# EAGLE design PWM-Shield-v12 (EAGLE 5.06)
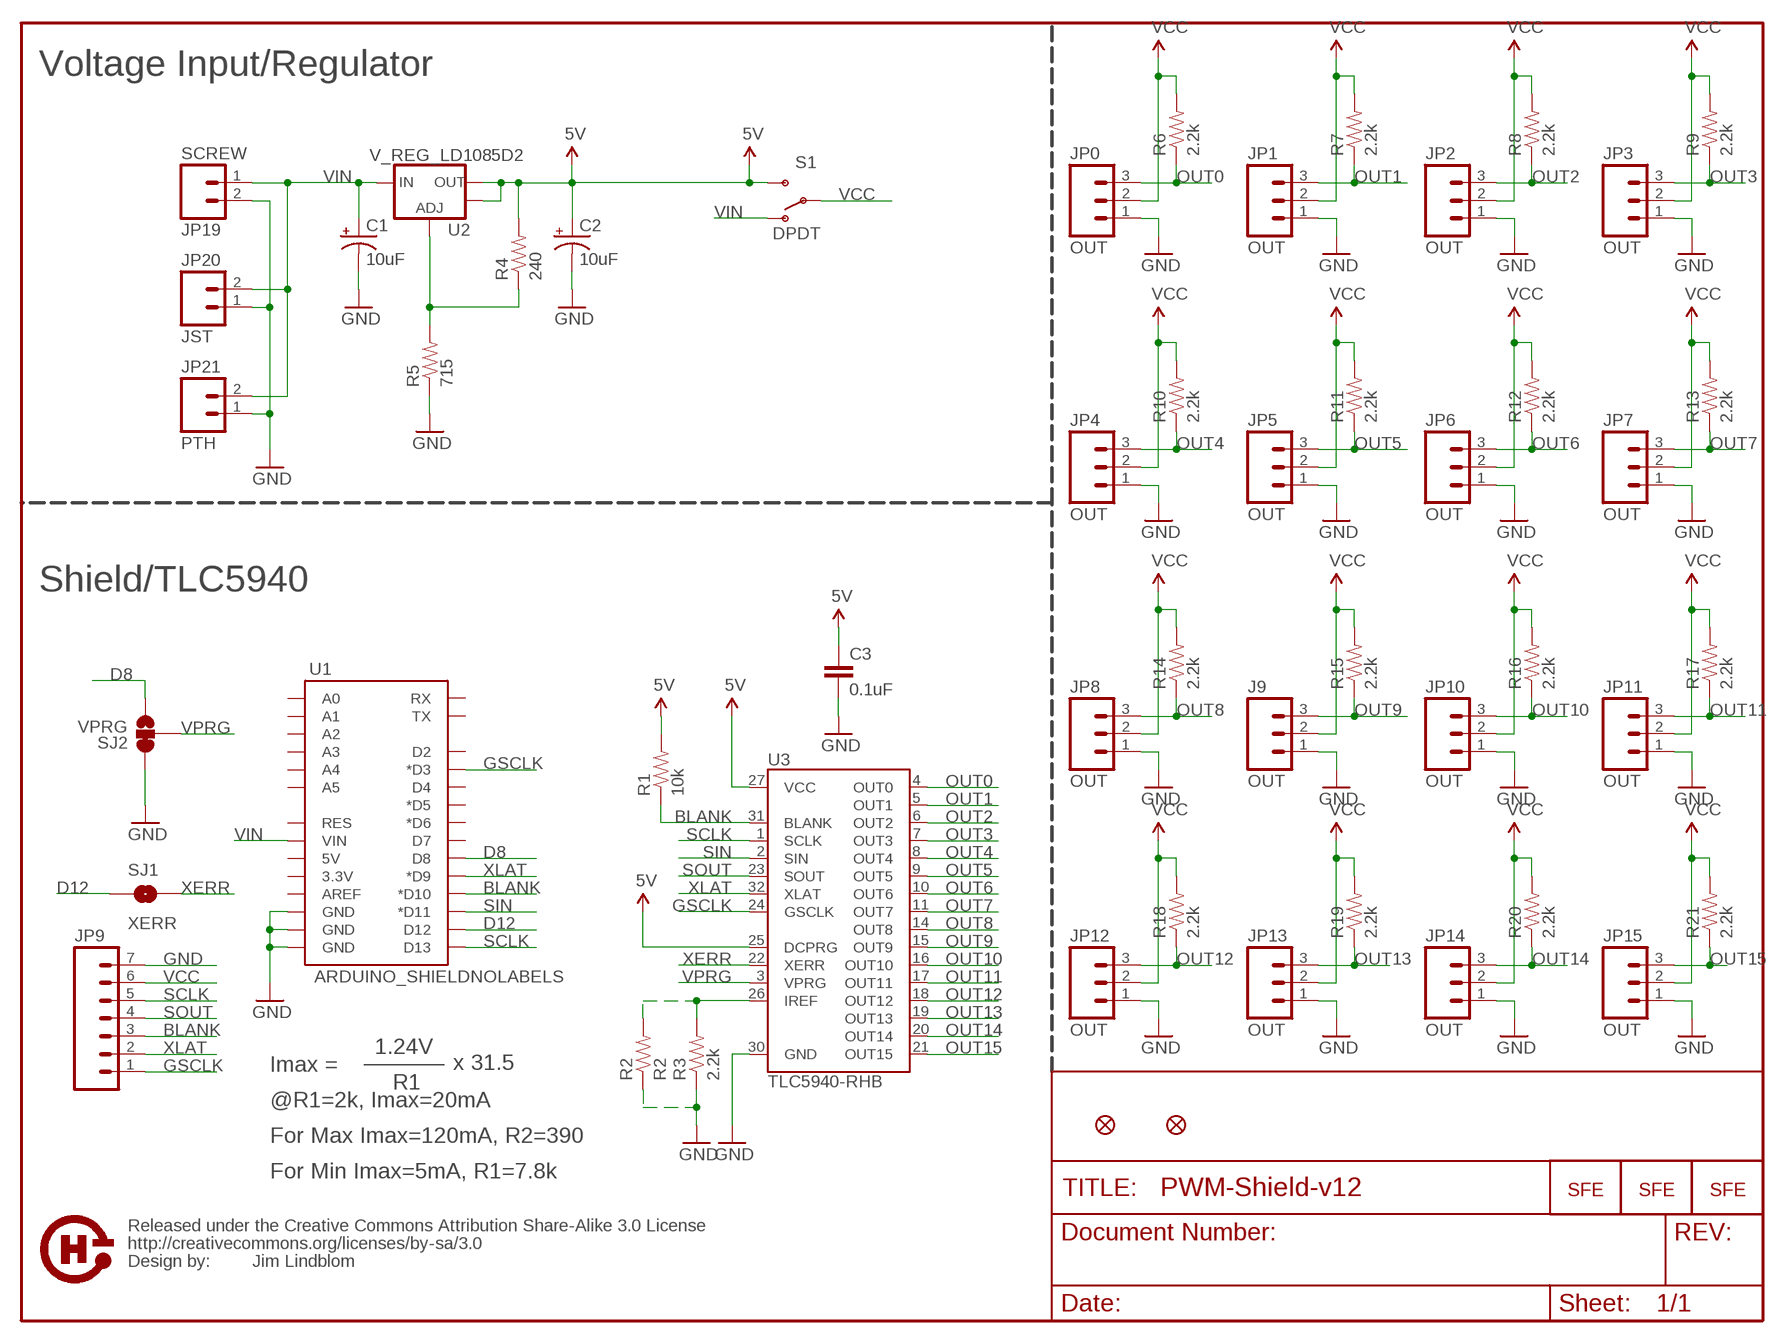
[diagram p0: schematic, sheet 1]

## Parts
C1  10uF  CAP_POL3528  [EIA3528]
C2  10uF  CAP_POL1206  [EIA3216]
C3  0.1uF  CAP0402-CAP  [0402-CAP]
J9  OUT  M03PTH  [1X03]
JP0  OUT  M03PTH  [1X03]
JP1  OUT  M03PTH  [1X03]
JP2  OUT  M03PTH  [1X03]
JP3  OUT  M03PTH  [1X03]
JP4  OUT  M03PTH  [1X03]
JP5  OUT  M03PTH  [1X03]
JP6  OUT  M03PTH  [1X03]
JP7  OUT  M03PTH  [1X03]
JP8  OUT  M03PTH  [1X03]
JP9  M07  [1X07]
JP10  OUT  M03PTH  [1X03]
JP11  OUT  M03PTH  [1X03]
JP12  OUT  M03PTH  [1X03]
JP13  OUT  M03PTH  [1X03]
JP14  OUT  M03PTH  [1X03]
JP15  OUT  M03PTH  [1X03]
JP16  LOGO-SFENEW  [SFE-NEW-WEBLOGO]
JP17  LOGO-SFESK  [SFE-LOGO-FLAME]
JP18  LOGO-SFENW2  [SFE-NEW-WEB]
JP19  SCREW  M023.5MM-NO_SILK  [SCREWTERMINAL-3.5MM-2-NS]
JP20  JST  M02JST-PTH-2  [JST-2-PTH]
JP21  PTH  M02PTH  [1X02]
JP22  FIDUCIAL1X2  [FIDUCIAL-1X2]
JP23  FIDUCIAL1X2  [FIDUCIAL-1X2]
R1  10k  RESISTOR0402-RES  [0402-RES]
R2  R2  RESISTORAXIAL-0.3  [AXIAL-0.3]
R3  2.2k  RESISTOR0402-RES  [0402-RES]
R4  240  RESISTOR0402-RES  [0402-RES]
R5  715  RESISTOR0402-RES  [0402-RES]
R6  2.2k  RESISTOR0402-RES  [0402-RES]
R7  2.2k  RESISTOR0402-RES  [0402-RES]
R8  2.2k  RESISTOR0402-RES  [0402-RES]
R9  2.2k  RESISTOR0402-RES  [0402-RES]
R10  2.2k  RESISTOR0402-RES  [0402-RES]
R11  2.2k  RESISTOR0402-RES  [0402-RES]
R12  2.2k  RESISTOR0402-RES  [0402-RES]
R13  2.2k  RESISTOR0402-RES  [0402-RES]
R14  2.2k  RESISTOR0402-RES  [0402-RES]
R15  2.2k  RESISTOR0402-RES  [0402-RES]
R16  2.2k  RESISTOR0402-RES  [0402-RES]
R17  2.2k  RESISTOR0402-RES  [0402-RES]
R18  2.2k  RESISTOR0402-RES  [0402-RES]
R19  2.2k  RESISTOR0402-RES  [0402-RES]
R20  2.2k  RESISTOR0402-RES  [0402-RES]
R21  2.2k  RESISTOR0402-RES  [0402-RES]
S1  DPDT  SWITCH-SPSTSMD  [AYZ0202]
SJ1  XERR  SOLDERJUMPERNO  [SJ_2S-NO]
SJ2  VPRG  SOLDERJUMPER_2WAYS  [SJ_3]
U1  ARDUINO_SHIELDNOLABELS  [DUEMILANOVE_SHIELD_NOLABELS]
U2  V_REG_LD1085D2  [D2PACK/A]
U3  TLC5940-RHB  [QFN-32]
U$1  OSHW-LOGOORB  [OSHW-LOGO-GO]
U$2  CREATIVE_COMMONS  [CREATIVE_COMMONS]

## Nets
5V: C2.A(+) C3.1 R1.2 R4.2 S1.3(S) U2.2(OUT) U2.TAB(OUT) U3.25(DCPRG) U3.27(VCC)
BLANK: JP9.3 R1.1 U1.D10(*D10) U3.31(BLANK)
D8: SJ2.3 U1.D8
D12: SJ1.1 U1.D12
GND: C1.C(-) C2.C(-) C3.2 J9.1 JP0.1 JP1.1 JP2.1 JP3.1 JP4.1 JP5.1 JP6.1 JP7.1 JP8.1 JP9.7 JP10.1 JP11.1 JP12.1 JP13.1 JP14.1 JP15.1 JP19.2 JP20.1 JP21.1 R2.P$1 R3.1 R5.1 SJ2.1 U1.GND@0(GND) U1.GND@1(GND) U1.GND@2(GND) U3.30(GND)
GSCLK: JP9.1 U1.D3(*D3) U3.24(GSCLK)
N$2: R4.1 R5.2 U2.1(ADJ)
N$8: R2.P$2 R3.2 U3.26(IREF)
OUT0: JP0.3 R6.1 U3.4(OUT0)
OUT1: JP1.3 R7.1 U3.5(OUT1)
OUT2: JP2.3 R8.1 U3.6(OUT2)
OUT3: JP3.3 R9.1 U3.7(OUT3)
OUT4: JP4.3 R10.1 U3.8(OUT4)
OUT5: JP5.3 R11.1 U3.9(OUT5)
OUT6: JP6.3 R12.1 U3.10(OUT6)
OUT7: JP7.3 R13.1 U3.11(OUT7)
OUT8: JP8.3 R14.1 U3.14(OUT8)
OUT9: J9.3 R15.1 U3.15(OUT9)
OUT10: JP10.3 R16.1 U3.16(OUT10)
OUT11: JP11.3 R17.1 U3.17(OUT11)
OUT12: JP12.3 R18.1 U3.18(OUT12)
OUT13: JP13.3 R19.1 U3.19(OUT13)
OUT14: JP14.3 R20.1 U3.20(OUT14)
OUT15: JP15.3 R21.1 U3.21(OUT15)
SCLK: JP9.5 U1.D13 U3.1(SCLK)
SIN: U1.D11(*D11) U3.2(SIN)
SOUT: JP9.4 U3.23(SOUT)
VCC: J9.2 JP0.2 JP1.2 JP2.2 JP3.2 JP4.2 JP5.2 JP6.2 JP7.2 JP8.2 JP9.6 JP10.2 JP11.2 JP12.2 JP13.2 JP14.2 JP15.2 R6.2 R7.2 R8.2 R9.2 R10.2 R11.2 R12.2 R13.2 R14.2 R15.2 R16.2 R17.2 R18.2 R19.2 R20.2 R21.2 S1.2(P)
VIN: C1.A(+) JP19.1 JP20.2 JP21.2 S1.1(O) U1.VIN U2.3(IN)
VPRG: SJ2.2 U3.3(VPRG)
XERR: SJ1.2 U3.22(XERR)
XLAT: JP9.2 U1.D9(*D9) U3.32(XLAT)
Unconnected: U1.3.3V U1.5V U1.A0 U1.A1 U1.A2 U1.A3 U1.A4 U1.A5 U1.AREF U1.D2 U1.D4 U1.D5(*D5) U1.D6(*D6) U1.D7 U1.RES U1.RX U1.TX

## Notes on the sheet
- Voltage Input/Regulator
- Shield/TLC5940
- 1.24V
- Imax = | x 31.5
- R1
- @R1=2k, Imax=20mA
- For Max Imax=120mA, R2=390
- For Min Imax=5mA, R1=7.8k
- Jim Lindblom

## Library data of the parts
C1 C2 = SparkFun:CAP_POL: Capacitor Polarized These are standard SMD and PTH capacitors. Normally 10uF, 47uF, and 100uF in electrolytic and tantalum varieties. Always verify the external diameter of the through hole cap, it varies with capacity, voltage, and manufacturer. The EIA devices should be standard.
C3 = SparkFun:CAP: Capacitor Standard 0603 ceramic capacitor, and 0.1" leaded capacitor.
J9 JP0 JP1-JP8 JP10-JP15 = SparkFun:M03: Header 3 Standard 3-pin 0.1" header. Use with straight break away headers (SKU : PRT-00116), right angle break away headers (PRT-00553), swiss pins (PRT-00743), machine pins (PRT-00117), and female headers (PRT-00115). Molex polarized connector foot print use with SKU : PRT-08232 with associated crimp pins and housings.
JP9 = SparkFun:M07: Header 7 Standard 7-pin 0.1" header. Use with straight break away headers (SKU : PRT-00116), right angle break away headers (PRT-00553), swiss pins (PRT-00743), machine pins (PRT-00117), and female headers (PRT-00115). NOTES ON THE VARIANTS LOCK and LOCK_LONGPADS... This footprint was designed to help hold the alignment of a through-hole component (i.e. 7-pin header) while soldering it into place. You may notice that each hole has been shifted either up or down by 0.005 of an inch from it's more standard position (which is usually a perfectly straight line). This slight alteration caused the pins (the squares in the middle) to touch the edges of the holes. Because they are alternating, it causes a "brace" to hold the header in place. 0.005 has proven to be the perfect amount of "off-center" position when using our standard breakaway headers. Although looks a little odd when you look at the bare footprint, once you have a header in there, the alteration is very hard to notice. Also, if you push a header all the way into place, it is covered up entirely on the bottom side. This idea of altering the position of holes to aid alignment will be further integrated into the Sparkfun Library for other footprints. It can help hold any component with 3 or more connection pins.
JP16-JP18 = SparkFun:LOGO-SFE: Spark Fun Electronics PCB Logo This is the standard Spark Fun Electronics PCB logo.
JP19-JP21 = SparkFun:M02: Header 2 Standard 2-pin 0.1" header. Use with straight break away headers (SKU : PRT-00116), right angle break away headers (PRT-00553), swiss pins (PRT-00743), machine pins (PRT-00117), and female headers (PRT-00115). Molex polarized connector foot print use with SKU : PRT-08233 with associated crimp pins and housings.
JP22 JP23 = SparkFun:FIDUCIAL: Fiducial Alignment Points Various fiducial points for machine vision alignment.
R1-R21 = SparkFun:RESISTOR: Resistor Basic schematic elements and footprints for 0603, 1206, and PTH resistors.
S1 = SparkFun:SWITCH-SPST: SPST Switch Simple slide switch. Spark Fun Electronics SKU : COM-00102
SJ1 = SparkFun:SOLDERJUMPER: Solder Jumper Standard SMD solder jumper. Used to automate production. Two varients : Normally Open and Normally Closed are the same, but have different paste layers. NC will have a large amount of paste and should jumper during reflow.
SJ2 = SparkFun:SOLDERJUMPER_2WAY: Solder Jumper 2 way solder jumper
U1 = SparkFun:ARDUINO_SHIELD
U2 = SparkFun:V_REG_LD1085: LD1085 3A low-drop positive voltage regulator, adjustable The LD1085xx is a low drop voltage regulator able to provide up to 3 A of output current. Dropout is guaranteed at a maximum of 1.2 V at the maximum output current, decreasing at lower loads. The LD1085xx is pin to pin compatible with the older 3-terminal adjustable regulators, but has better performances in term of drop and output tolerance. Available Packages D2PAK/A - 3-pin w/ tabs, SMD
U3 = SparkFun:TLC5940: TI TLC5940 16-channel LED Driver with Dot Correction and Grayscale PWM Control The TLC5940 is a 16-channel, constant-current sink LED driver. Each channel has an individually adjustable 4096-step grayscale PWM brightness control and a 64-step, constant-current sink (dot correction). The dot correction adjusts the brightness variations between LED channels and other LED drivers. The dot correction data is stored in an integrated EEPROM. Both grayscale control and dot correction are accessible via a serial interface. A single external resistor sets the maximum current value of all 16 channels. Packages: 28-pin HTSSOP 32-pin 5x5mm QFN 28-pin DIP
U$1 = SparkFun:OSHW-LOGO: Open Source Hardware Logo This logo indicates the piece of hardware it is found on incorporates a OSHW license and/or adheres to the definition of open source hardware found here: http://freedomdefined.org/OSHW
U$2 = SparkFun:CREATIVE_COMMONS

## Board
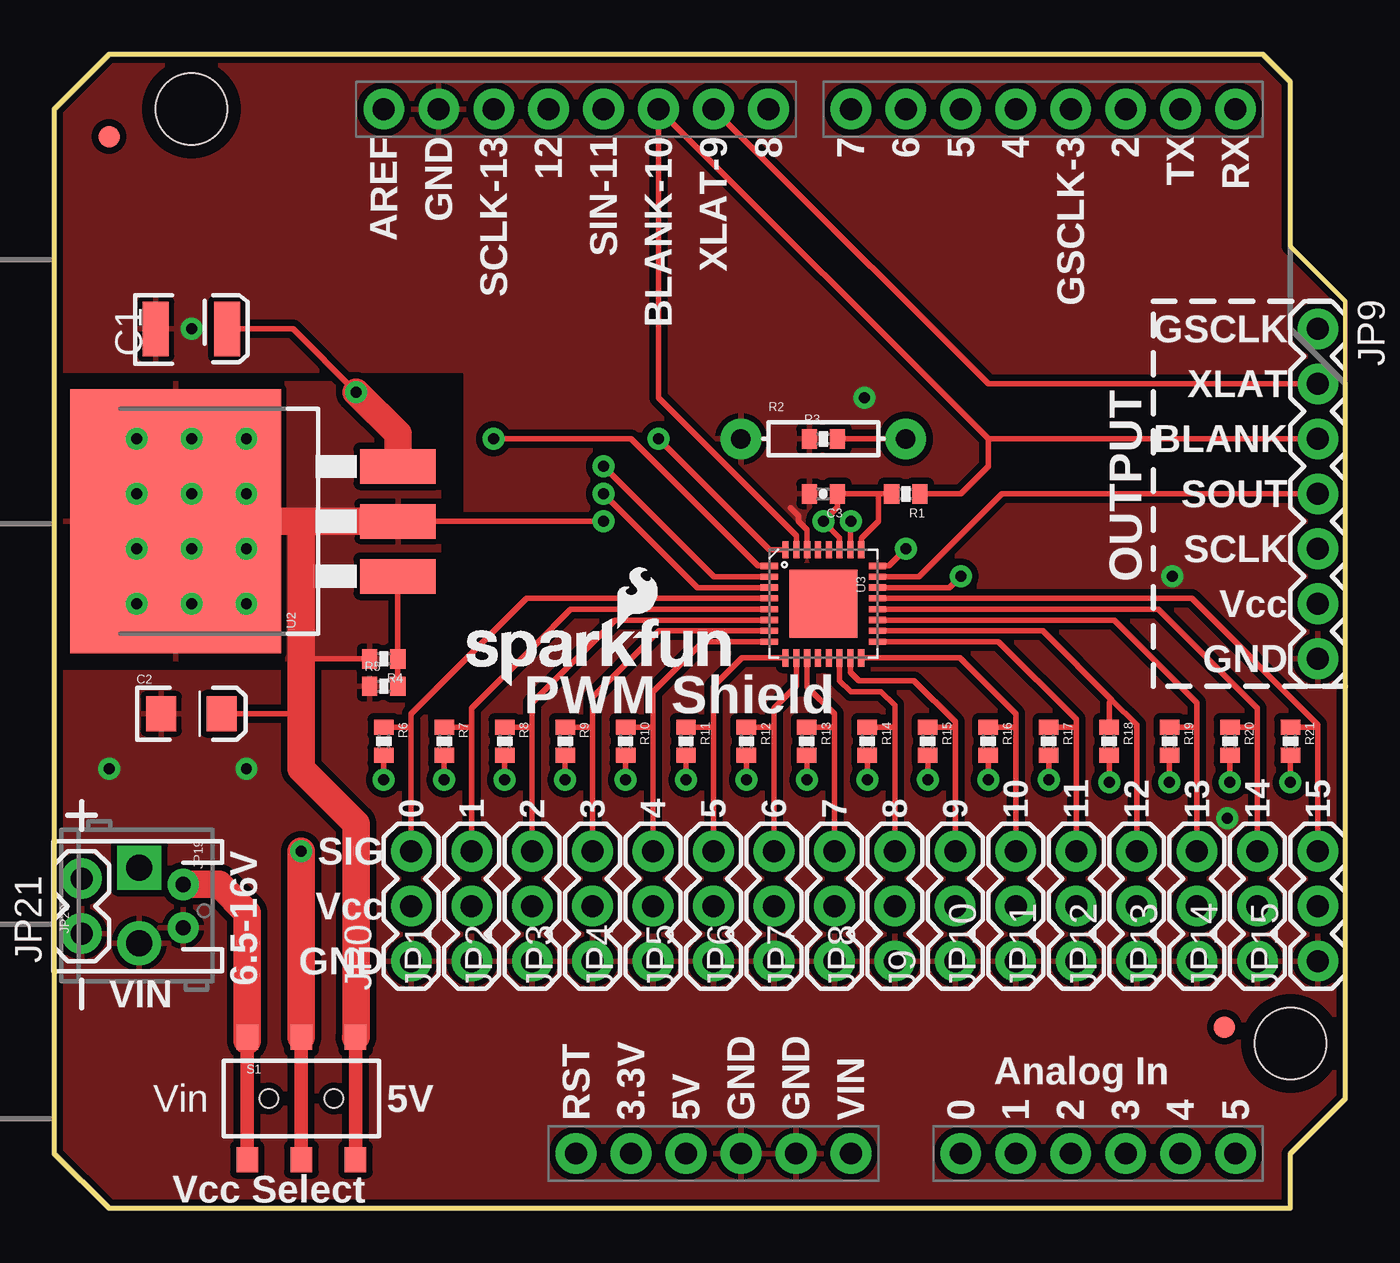
[diagram p1: board, top side]
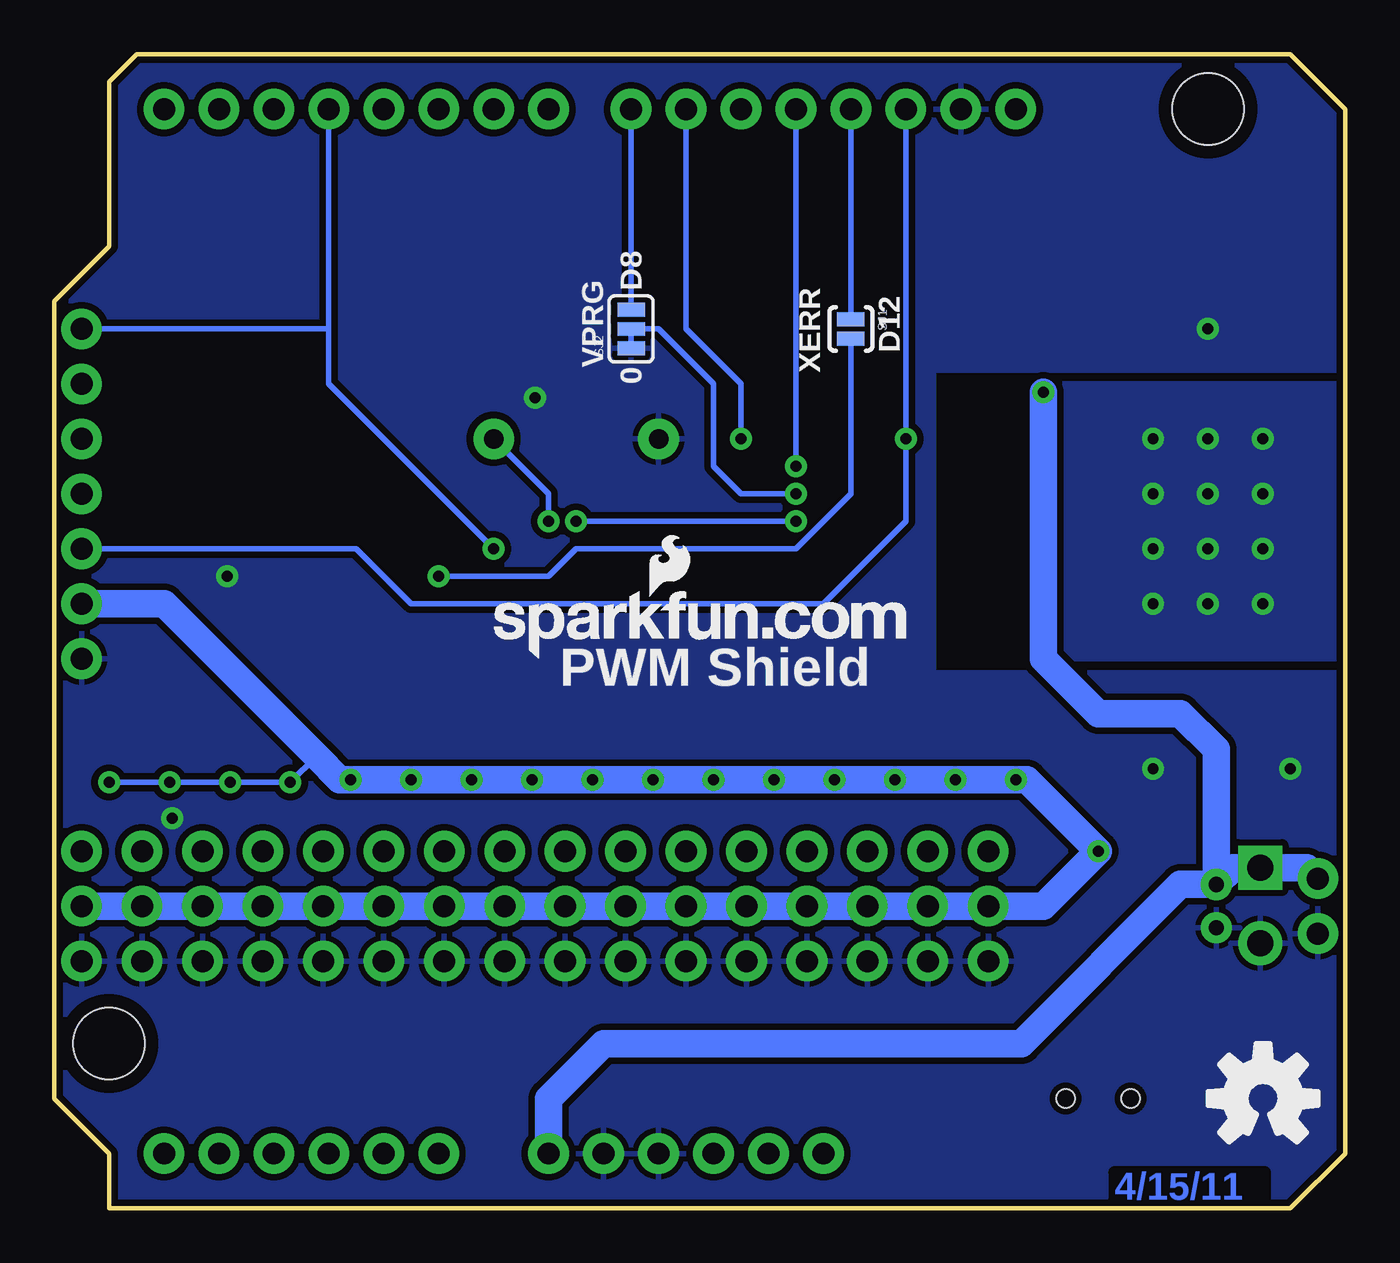
[diagram p2: board, bottom side, seen from below]

Size 59.69 x 53.34 mm. Coordinates in mm from the lower left corner, seen from the top.
Outline: 0,50.8 2.54,53.34 55.88,53.34 57.15,52.07 57.15,44.45 59.69,41.91 59.69,5.08 57.15,2.54 57.15,0 2.54,0 0,2.54 0,50.8
Copper layers (1*16): Top 0.035mm / dielectric 1.5mm / Bottom 0.035mm
Design rules "SparkFun *": minimum track width 8mil, minimum drill 20mil, track to track 8mil, track to pad 8mil, pad to pad 8mil, via to via 8mil, smd to smd 8mil, copper to edge 8mil, drill to drill 8mil, minimum pad ring 12mil, minimum via ring 10mil, stop-mask expansion 4mil, vias tented up to drill 20mil, thermal gap 10mil

### Footprints (pad centres in the part's own frame; a part is rotated, then mirrored left to right if it is on the bottom)
EIA3528 = smd 1.2 x 2.5: A 1.65,0; C -1.65,0
EIA3216 = smd 1.4 x 1.6: A 1.4,0; C -1.4,0
0402-CAP = smd 0.7 x 0.9: 1 -0.65,0; 2 0.65,0
1X03 = drill 1.016 pad 1.88 round: 1 0,0; 2 2.54,0; 3 5.08,0
1X07 = drill 1.016 pad 1.88 round: 1 0,0; 2 2.54,0; 3 5.08,0; 4 7.62,0; 5 10.16,0; 6 12.7,0; 7 15.24,0
SCREWTERMINAL-3.5MM-2-NS = drill 1.2 pad 2.032 square: 1 0,0 | drill 1.2 pad 2.032 round: 2 3.5,0
JST-2-PTH = drill 0.7 pad 1.448 round: 1 -1,0; 2 1,0
1X02 = drill 1.016 pad 1.88 round: 1 0,0; 2 2.54,0
FIDUCIAL-1X2 = smd 1 x 1: 1 0,0
0402-RES = smd 0.7 x 0.9: 1 -0.65,0; 2 0.65,0
AXIAL-0.3 = drill 0.9 pad 1.88 round: P$1 -3.81,0; P$2 3.81,0
AYZ0202 = smd 1 x 1.15: 1 -2.5,2.825; 2 0,2.825; 3 2.5,2.825; 4 -2.5,-2.825; 5 0,-2.825; 6 2.5,-2.825 | hole 0.85: 1.5,0; -1.5,0
SJ_2S-NO = smd 0.635 x 1.27: 1 -0.45,0; 2 0.45,0
SJ_3 = smd 0.635 x 1.27: 1 -0.889,0; 2 0,0; 3 0.889,0
DUEMILANOVE_SHIELD_NOLABELS = drill 1.016 pad 1.88 round: 3.3V 50.8,26.67; 5V 50.8,29.21; A0 50.8,41.91; A1 50.8,44.45; A2 50.8,46.99; A3 50.8,49.53; A4 50.8,52.07; A5 50.8,54.61; AREF 2.54,15.24; D2 2.54,49.53; D3 2.54,46.99; D4 2.54,44.45; D5 2.54,41.91; D6 2.54,39.37; D7 2.54,36.83; D8 2.54,33.02; D9 2.54,30.48; D10 2.54,27.94; D11 2.54,25.4; D12 2.54,22.86; D13 2.54,20.32; GND@0 50.8,31.75; GND@1 50.8,34.29; GND@2 2.54,17.78; RES 50.8,24.13; RX 2.54,54.61; TX 2.54,52.07; VIN 50.8,36.83 | hole 3.302: 45.72,57.15; 2.54,6.35
D2PACK/A = smd 1.6 x 3.5: 1 -2.54,-8.275; 2 0,-8.275; 3 2.54,-8.275 | smd 12.2 x 9.75: TAB 0,2
QFN-32 = smd 0.285 x 0.8: 1 -1.75,-2.5; 2 -1.25,-2.5; 3 -0.75,-2.5; 4 -0.25,-2.5; 5 0.25,-2.5; 6 0.75,-2.5; 7 1.25,-2.5; 8 1.75,-2.5; 17 1.75,2.5; 18 1.25,2.5; 19 0.75,2.5; 20 0.25,2.5; 21 -0.25,2.5; 22 -0.75,2.5; 23 -1.25,2.5; 24 -1.75,2.5 | smd 0.8 x 0.285: 9 2.5,-1.75; 10 2.5,-1.25; 11 2.5,-0.75; 12 2.5,-0.25; 13 2.5,0.25; 14 2.5,0.75; 15 2.5,1.25; 16 2.5,1.75; 25 -2.5,1.75; 26 -2.5,1.25; 27 -2.5,0.75; 28 -2.5,0.25; 29 -2.5,-0.25; 30 -2.5,-0.75; 31 -2.5,-1.25; 32 -2.5,-1.75 | smd 3.15 x 3.15: EP 0,0

### Placement (x,y rotation side)
C1  6.35,40.64 0 top
C2  6.35,22.86 0 top
C3  35.56,33.02 180 top
J9  41.66,11.43 90 top
JP0  16.51,11.43 90 top
JP1  19.3,11.43 90 top
JP2  22.1,11.43 90 top
JP3  24.89,11.43 90 top
JP4  27.69,11.43 90 top
JP5  30.48,11.43 90 top
JP6  33.27,11.43 90 top
JP7  36.07,11.43 90 top
JP8  38.86,11.43 90 top
JP9  58.42,40.64 270 top
JP10  44.45,11.43 90 top
JP11  47.24,11.43 90 top
JP12  50.04,11.43 90 top
JP13  52.83,11.43 90 top
JP14  55.63,11.43 90 top
JP15  58.42,11.43 90 top
JP16  39.37,25.4 0 bottom
JP17  26.04,26.8 0 top
JP18  19.05,24.13 0 top
JP19  3.94,15.75 270 top
JP20  5.97,13.97 90 top
JP21  1.27,12.7 90 top
JP22  54.1,8.38 0 top
JP23  2.54,49.53 0 top
R1  39.37,33.02 180 top
R2  35.56,35.56 0 top
R3  35.56,35.56 0 top
R4  15.24,25.4 180 top
R5  15.24,24.13 0 top
R6  15.24,21.59 270 top
R7  18.03,21.59 270 top
R8  20.83,21.59 270 top
R9  23.62,21.59 270 top
R10  26.42,21.59 270 top
R11  29.21,21.59 270 top
R12  32,21.59 270 top
R13  34.8,21.59 270 top
R14  37.59,21.59 270 top
R15  40.39,21.59 270 top
R16  43.18,21.59 270 top
R17  45.97,21.59 270 top
R18  48.77,21.59 270 top
R19  51.56,21.59 270 top
R20  54.36,21.59 270 top
R21  57.15,21.59 270 top
S1  11.43,5.08 0 top
SJ1  22.86,40.64 270 bottom
SJ2  33.02,40.64 90 bottom
U1  0,53.34 270 top
U2  7.62,31.75 90 top
U3  35.56,27.94 270 top
U$1  3.81,5.08 0 bottom
U$2  5.08,11.43 0 top

### Tracks (layer width: path | path; a pad name or v marks a point on that pad's centre or on a via)
5V  (via drill 0.51)
  Top 0.254: 11.43,22.86 C2.A | 11.43,25.4 R4.2 | U3.27 36.31,31 v35.56,31.75 36.21,32.4 C3.1 38.1,33.02 | 6.35,31.75 v6.35,30.48 | 38.1,33.02 R1.2 | U3.25 37.31,30.96 38.1,31.75 38.1,33.02 | U2.2 16.51,31.75 v25.4,31.75
  Top 0.635: 13.93,2.29 S1.3
  Top 0.762: 6.35,31.75 U2.TAB
  Top 1.27: 11.43,31.75 6.35,31.75 | 11.43,31.75 16.51,31.75 | 11.43,31.75 11.43,22.86 11.43,20.32 13.97,17.78 13.97,7.95 S1.3
  Bottom 0.254: v25.4,31.75 v35.56,31.75
  other vias: 3.81,35.56 6.35,35.56 3.81,27.94 6.35,27.94 3.81,33.02 6.35,33.02 3.81,30.48 8.89,35.56 8.89,33.02 8.89,30.48 8.89,27.94
  pour Top (isolate 0.305): 0,38.1 0,25.4 17.78,25.4 17.78,38.1
  pour Bottom (isolate 0.305): 0,38.1 17.78,38.1 17.78,25.4 0,25.4
BLANK
  Top 0.254: U3.31 34.31,31.09 27.94,37.47 U1.D10 43.18,35.56 | R1.1 41.91,33.02 43.18,34.29 43.18,35.56 | 43.18,35.56 JP9.3
D8
  Bottom 0.254: SJ2.3 U1.D8
D12
  Bottom 0.254: SJ1.1 U1.D12
GND  (via drill 0.51)
  Top 0.254: U3.30 34.81,31.36 34.42,31.75 34.42,32 34.04,32.38
  other vias: 2.54,20.32 37.47,37.47 51.69,29.21 6.35,40.64 54.23,18.03 8.89,20.32
  pour Top (isolate 0.305): 0,53.34 0,38.73 19.05,38.73 19.05,24.77 0,24.77 0,0 59.69,0 59.69,53.34
  pour Bottom (isolate 0.305): 0,53.34 0,38.73 19.05,38.73 19.05,24.77 0,24.77 0,0 59.69,0 59.69,53.34
GSCLK  (via drill 0.51)
  Top 0.254: U3.24 38.58,29.69 v39.37,30.48
  Bottom 0.254: v39.37,30.48 46.99,38.1 46.99,40.64 | 46.99,40.64 U1.D3 | 46.99,40.64 JP9.1
N$2
  Top 0.254: R5.2 R4.1 U2.1
N$8  (via drill 0.51)
  Top 0.254: U3.26 36.81,31.73 v36.83,31.75 | R2.P$2 R3.2
  Bottom 0.254: v36.83,31.75 36.83,33.02 R2.P$2
OUT0
  Top 0.254: U3.4 21.84,28.19 16.51,22.86 16.51,22.23 | JP0.3 16.51,22.23 | 16.51,22.23 16.5,22.24 | 16.51,22.23 15.26,22.23 R6.1
OUT1
  Top 0.254: JP1.3 19.3,22.23 | 19.3,22.23 19.3,23.11 22.23,26.04 | 22.23,26.04 22.86,26.67 | U3.5 23.88,27.69 22.23,26.04 | 19.3,22.23 19.29,22.24 R7.1
OUT2
  Top 0.254: U3.6 25.92,27.19 22.1,23.37 22.1,22.23 | JP2.3 22.1,22.23 | 22.1,22.23 22.08,22.24 | 22.1,22.23 20.84,22.23 R8.1
OUT3
  Top 0.254: JP3.3 24.89,22.23 | 24.89,22.23 24.89,23.62 27.96,26.69 U3.7 | 24.89,22.23 24.88,22.24 | 24.89,22.23 23.64,22.23 R9.1
OUT4
  Top 0.254: JP4.3 27.69,22.23 | 27.69,22.23 27.69,23.88 30,26.19 U3.8 | R10.1 27.67,22.24 27.69,22.23
OUT5
  Top 0.254: U3.9 31.79,25.44 30.48,24.13 30.48,22.23 | JP5.3 30.48,22.23 | R11.1 30.46,22.24 30.48,22.23
OUT6
  Top 0.254: U3.10 34.31,24.15 33.27,23.11 33.27,22.23 | JP6.3 33.27,22.23 | R12.1 33.26,22.24 33.27,22.23
OUT7
  Top 0.254: U3.11 34.81,24.12 36.07,22.86 36.07,22.23 | JP7.3 36.07,22.23 | R13.1 36.05,22.24 36.07,22.23
OUT8
  Top 0.254: JP8.3 38.86,22.23 | R14.1 38.85,22.24 38.86,22.23 | U3.14 36.31,24.4 36.83,23.88 38.23,23.88 38.86,23.24 38.86,22.23
OUT9
  Top 0.254: U3.15 36.81,24.79 37.21,24.38 39.75,24.38 41.66,22.48 41.66,22.23 | J9.3 41.66,22.23 | R15.1 41.64,22.24 41.66,22.23
OUT10
  Top 0.254: U3.16 41.87,25.44 44.45,22.86 44.45,22.23 | JP10.3 44.45,22.23 | R16.1 44.44,22.24 44.45,22.23
OUT11
  Top 0.254: JP11.3 47.24,22.23 | 47.24,22.23 47.24,22.61 43.66,26.19 U3.17 | R17.1 47.23,22.24 47.24,22.23
OUT12
  Top 0.254: 50.04,22.23 50.04,22.35 48.9,23.5 | 50.04,22.23 JP12.3 | U3.18 45.7,26.69 48.9,23.5 | 50.04,22.23 50.02,22.24 | R18.1 48.77,23.37 48.9,23.5
OUT13
  Top 0.254: 52.83,22.23 52.83,23.37 49.01,27.19 U3.19 | 52.83,22.23 JP13.3 | R19.1 52.82,22.24 52.83,22.23
OUT14
  Top 0.254: 55.63,22.23 55.63,23.11 51.05,27.69 U3.20 | 55.63,22.23 JP14.3 | R20.1 55.61,22.24 55.63,22.23
OUT15
  Top 0.254: 58.42,22.23 58.42,22.35 52.58,28.19 U3.21 | 58.42,22.23 JP15.3 | R21.1 58.41,22.24 58.42,22.23
SCLK  (via drill 0.51)
  Top 0.254: v20.32,35.56 26.67,35.56 32.54,29.69 U3.1
  Bottom 0.254: U1.D13 v20.32,35.56 20.32,31.75 24.13,27.94 43.18,27.94 45.72,30.48 JP9.5
SIN  (via drill 0.51)
  Top 0.254: U3.2 30.5,29.19 v25.4,34.29
  Bottom 0.254: v25.4,34.29 U1.D11
SOUT
  Top 0.254: U3.23 39.98,29.19 43.81,33.02 JP9.4
VCC  (via drill 0.51)
  Top 0.254: v15.24,19.81 R6.2 | v18.03,19.81 R7.2 | v20.83,19.81 R8.2 | v23.62,19.81 R9.2 | v26.42,19.81 R10.2 | v29.21,19.81 R11.2 | v32,19.81 R12.2 | v34.8,19.81 R13.2 | v37.59,19.81 R14.2 | v40.39,19.81 R15.2 | v43.18,19.81 R16.2 | v45.97,19.81 R17.2 | v48.77,19.68 R18.2 | v51.56,19.68 R19.2 | v54.36,19.68 R20.2 | v57.15,19.68 R21.2
  Top 0.635: 11.43,2.29 11.43,7.62 | 11.43,7.62 11.43,7.87 | 11.43,7.62 S1.2
  Top 1.27: S1.2 v11.43,16.51
  Bottom 0.254: 47.56,20.89 v48.77,19.68 v51.56,19.68 v54.36,19.68 v57.15,19.68
  Bottom 1.27: JP15.2 JP14.2 JP13.2 JP12.2 JP11.2 JP10.2 J9.2 JP8.2 JP7.2 JP6.2 JP5.2 JP4.2 JP3.2 JP2.2 JP1.2 JP0.2 13.97,13.97 v11.43,16.51 14.73,19.81 v15.24,19.81 v18.03,19.81 v20.83,19.81 v23.62,19.81 v26.42,19.81 v29.21,19.81 v32,19.81 v34.8,19.81 v37.59,19.81 v40.39,19.81 v43.18,19.81 v45.97,19.81 46.48,19.81 47.56,20.89 54.61,27.94 JP9.6
VIN  (via drill 0.51)
  Top 0.254: C1.A 11.05,40.64 v13.97,37.72
  Top 0.635: 8.93,2.29 8.93,7.75
  Top 1.27: U2.3 15.89,35.79 v13.97,37.72 | JP20.2 7.62,14.97 8.93,13.66 S1.1 8.93,7.75
  Bottom 1.27: JP21.2 1.78,15.75 JP19.1 5.19,15.75 JP20.2 | v13.97,37.72 13.97,25.4 11.43,22.86 7.62,22.86 5.97,21.21 JP20.2 | U1.VIN 36.83,5.08 34.29,7.62 14.97,7.62 7.62,14.97 JP20.2
VPRG  (via drill 0.51)
  Top 0.254: U3.3 29.73,28.69 v25.4,33.02
  Bottom 0.254: v25.4,33.02 27.94,33.02 29.21,34.29 29.21,38.1 31.75,40.64 SJ2.2 33.02,39.75
XERR  (via drill 0.51)
  Top 0.254: U3.22 41.39,28.69 v41.91,29.21
  Bottom 0.254: SJ1.2 22.86,33.02 25.4,30.48 35.56,30.48 36.83,29.21 v41.91,29.21
XLAT  (via drill 0.51)
  Top 0.254: U1.D9 32.38,48.9 | 32.38,48.9 33.02,48.26 | U3.32 33.06,30.44 v27.94,35.56 | JP9.2 43.18,38.1 32.38,48.9
  Bottom 0.254: v27.94,35.56 27.94,38.1 30.48,40.64 U1.D9

### Text on the board
Bottom: 4/15/11
tPlace: AREF | GND | SCLK-13 | 12 | SIN-11 | BLANK-10 | XLAT-9 | 8 | 7 | 6 | 5 | 4 | GSCLK-3 | 2 | TX | RX | GSCLK | XLAT | BLANK | SOUT | SCLK | OUTPUT | Vcc | GND | PWM Shield | 0 | 1 | 2 | 3 | 4 | 5 | 6 | 7 | 8 | 9 | 10 | 11 | 12 | 13 | 14 | 15 | SIG | Vcc | GND | 6.5-16V | VIN | Analog In | Vin | 5V | RST | 3.3V | 5V | GND | GND | VIN | 0 | 1 | 2 | 3 | 4 | 5 | Vcc Select
bPlace: XERR | D12 | D8 | VPRG | 0 | PWM Shield